# EAGLE design µ-USBasp_v1.1 (EAGLE 6.3)
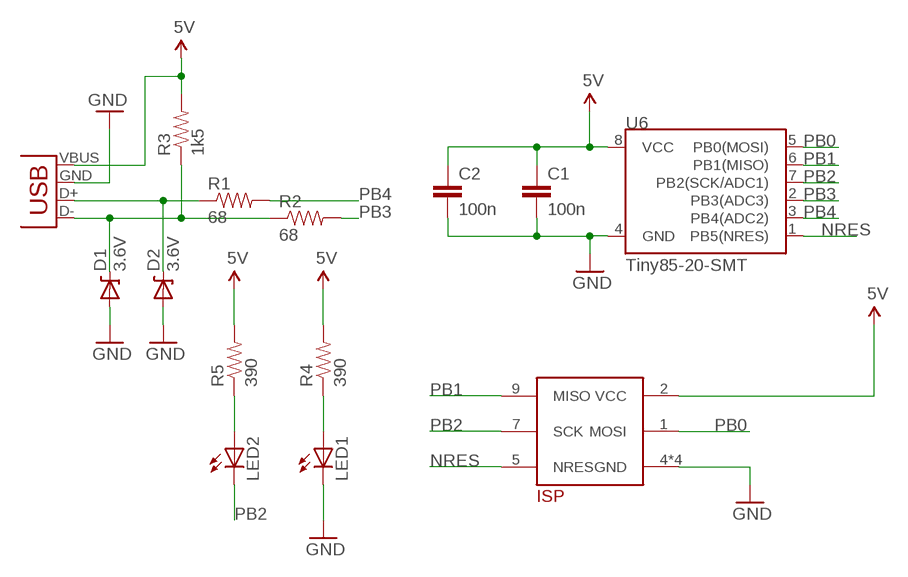
[diagram p0: schematic, sheet 1]

## Parts
C1  100n  CAP0805  [0805]
C2  100n  CAP0805  [0805]
D1  3.6V  DIODE-ZENER-BZT52  [SOD-323]
D2  3.6V  DIODE-ZENER-BZT52  [SOD-323]
JP2  USB-A-H  [USB-A-H]
LED1  LEDCHIPLED_0805  [CHIPLED_0805]
LED2  LEDCHIPLED_0805  [CHIPLED_0805]
R1  68  RESISTOR0805-RES  [0805]
R2  68  RESISTOR0805-RES  [0805]
R3  1k5  RESISTOR0805-RES  [0805]
R4  390  RESISTOR0805-RES  [0805]
R5  390  RESISTOR0805-RES  [0805]
U6  Tiny85-20-SMT  ATTINY45TINY85-20-SMT  [SO08-EIAJ]
U$1  TB_ISPEDGE_2X5_LONG  [ISP_EDGE2X5_LONG]

## Nets
5V [Power]: C1.1 C2.1 JP2.VBUS(GND) R3.2 R4.2 R5.2 U6.8(VCC) U$1.2(VCC)
GND [Power]: C1.2 C2.2 D1.2(A) D2.2(A) JP2.GND(VBUS) LED1.C U6.4(GND) U$1.4(GND) U$1.6(GND) U$1.8(GND) U$1.10(GND)
N$1: D1.1(C) JP2.D-(D+) R2.1 R3.1
N$2: D2.1(C) JP2.D+(D-) R1.1
N$3: LED1.A R4.1
N$5: LED2.A R5.1
NRES: U6.1(PB5(NRES)) U$1.5(NRES)
PB0: U6.5(PB0(MOSI)) U$1.1(MOSI)
PB1: U6.6(PB1(MISO)) U$1.9(MISO)
PB2: LED2.C U6.7(PB2(SCK/ADC1)) U$1.7(SCK)
PB3: R2.2 U6.2(PB3(ADC3))
PB4: R1.2 U6.3(PB4(ADC2))

## Library data of the parts
C1 C2 = SparkFun-Capacitors:CAP: Capacitor Standard 0603 ceramic capacitor, and 0.1" leaded capacitor.
D1 D2 = SparkFun-DiscreteSemi:DIODE-ZENER: Zener Diode Production Part - 8199 3.4V Zener Voltage
JP2 = SparkFun-Connectors:USB: USB Connectors USB-B-PTH is fully proven SKU : PRT-00139/CONN-08278 USB-miniB is fully proven SKU : PRT-00587 USB-A-PCB is untested. USB-A-H is throughly reviewed, but untested. Spark Fun Electronics SKU : PRT-00437 USB-B-SMT is throughly reviewed, but untested. Needs silkscreen touching up. USB-A-S has not been used/tested USB-MB-H has not been used/tested USB-MICROB has been used. CONN-09505
LED1 LED2 = led:LED: LED OSRAM: - CHIPLED LG R971, LG N971, LY N971, LG Q971, LY Q971, LO R971, LY R971 LH N974, LH R974 LS Q976, LO Q976, LY Q976 LO Q996 - Hyper CHIPLED LW Q18S LB Q993, LB Q99A, LB R99A - SideLED LS A670, LO A670, LY A670, LG A670, LP A670 LB A673, LV A673, LT A673, LW A673 LH A674 LY A675 LS A676, LA A676, LO A676, LY A676, LW A676 LS A679, LY A679, LG A679 - Hyper Micro SIDELED® LS Y876, LA Y876, LO Y876, LY Y876 LT Y87S - SmartLED LW L88C, LW L88S LB L89C, LB L89S, LG L890 LS L89K, LO L89K, LY L89K LS L896, LA L896, LO L896, LY L896 - TOPLED LS T670, LO T670, LY T670, LG T670, LP T670 LSG T670, LSP T670, LSY T670, LOP T670, LYG T670 LG T671, LOG T671, LSG T671 LB T673, LV T673, LT T673, LW T673 LH T674 LS T676, LA T676, LO T676, LY T676, LB T676, LH T676, LSB T676, LW T676 LB T67C, LV T67C, LT T67C, LS T67K, LO T67K, LY T67K, LW E67C LS E67B, LA E67B, LO E67B, LY E67B, LB E67C, LV E67C, LT E67C LW T67C LS T679, LY T679, LG T679 LS T770, LO T770, LY T770, LG T770, LP T770 LB T773, LV T773, LT T773, LW T773 LH T774 LS E675, LA E675, LY E675, LS T675 LS T776, LA T776, LO T776, LY T776, LB T776 LHGB T686 LT T68C, LB T68C - Hyper Mini TOPLED® LB M676 - Mini TOPLED Santana® LG M470 LS M47K, LO M47K, LY M47K Source: http://www.osram.convergy.de LUXEON: - LUMILED® LXK2-PW12-R00, LXK2-PW12-S00, LXK2-PW14-U00, LXK2-PW14-V00 LXK2-PM12-R00, LXK2-PM12-S00, LXK2-PM14-U00 LXK2-PE12-Q00, LXK2-PE12-R00, LXK2-PE12-S00, LXK2-PE14-T00, LXK2-PE14-U00 LXK2-PB12-K00, LXK2-PB12-L00, LXK2-PB12-M00, LXK2-PB14-N00, LXK2-PB14-P00, LXK2-PB14-Q00 LXK2-PR12-L00, LXK2-PR12-M00, LXK2-PR14-Q00, LXK2-PR14-R00 LXK2-PD12-Q00, LXK2-PD12-R00, LXK2-PD12-S00 LXK2-PH12-R00, LXK2-PH12-S00 LXK2-PL12-P00, LXK2-PL12-Q00, LXK2-PL12-R00 Source: www.luxeon.com KINGBRIGHT: KA-3528ASYC Source: www.kingbright.com
R1-R5 = SparkFun-Passives:RESISTOR: Resistor Basic schematic elements and footprints for 0603, 1206, and PTH resistors.
U6 = SparkFun-DigitalIC:ATTINY45: Atmel 8-pin 2/4/8kB flash uC; PROD_ID: IC-09092
U$1 = tb_custom:TB_ISPEDGE_2X5_LONG: AVR ISP connector at PCB edge - long pads for soldering

## Net classes
1 Power: width 0.305 mm, clearance 0.305 mm

## Board
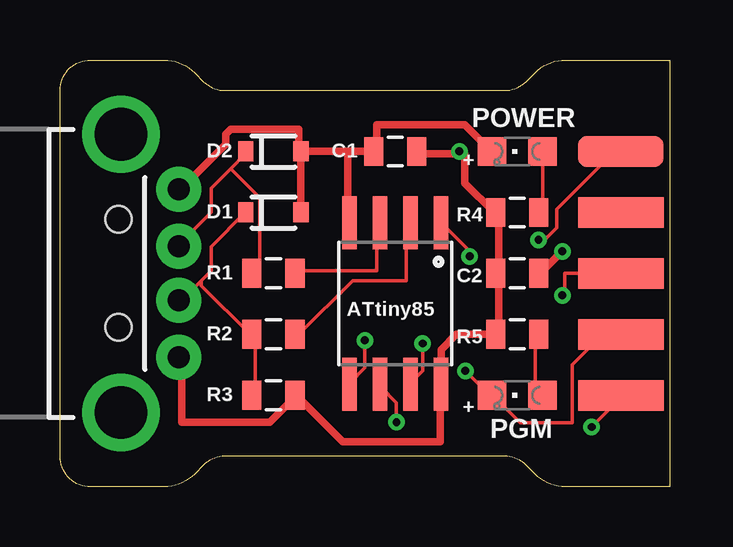
[diagram p1: board, top side]
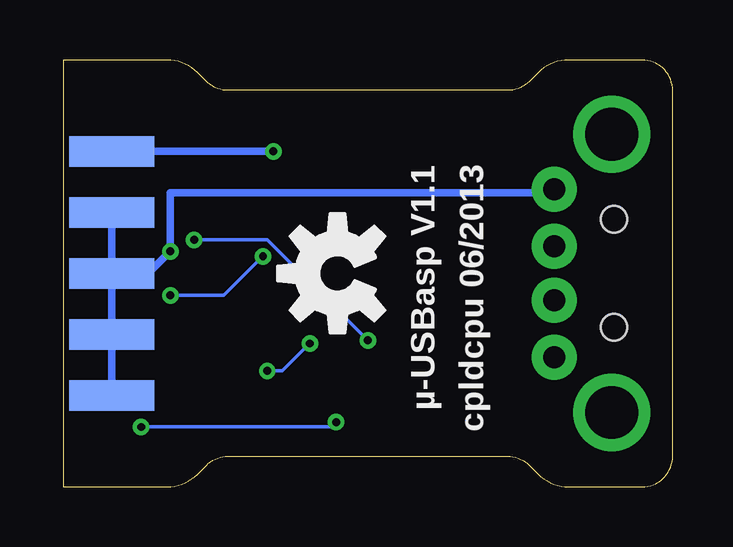
[diagram p2: board, bottom side, seen from below]

Size 25.4 x 17.78 mm. Coordinates in mm from the lower left corner, seen from the top.
Outline: 1.27,0 arc-90 0,1.27 0,16.51 arc-90 1.27,17.78 4.34,17.78 arc-45 5.61,17.25 5.98,16.88 arc45 6.88,16.51 18.52,16.51 arc45 19.42,16.88 19.79,17.25 arc-45 21.06,17.78 25.4,17.78 25.4,0 21.06,0 arc-45 19.79,0.53 19.42,0.9 arc45 18.52,1.27 6.88,1.27 arc45 5.98,0.9 5.61,0.53 arc-45 4.34,0 1.27,0
Copper layers (1*16): Top 0.0356mm / dielectric 1.5011mm / Bottom 0.0356mm
Design rules "LaenPCBOrder": minimum track width 6mil, minimum drill 13mil, track to track 6mil, track to pad 6mil, pad to pad 6mil, via to via 6mil, smd to smd 6mil, copper to edge 15mil, drill to drill 6mil, minimum pad ring 7mil, minimum via ring 7mil, stop-mask expansion 4mil, vias tented up to drill 0mil, thermal gap 10mil

### Footprints (pad centres in the part's own frame; a part is rotated, then mirrored left to right if it is on the bottom)
0805 = smd 0.8 x 1.2: 1 -0.9,0; 2 0.9,0
SOD-323 = smd 0.63 x 0.83: 1 -1.15,0; 2 1.15,0
USB-A-H = drill 0.914 pad 1.88: D+ 2.4,1.127; D- 2.4,-1.127; GND 2.4,3.5; VBUS 2.4,-3.5 | drill 2.2: GND2 0,-5.8; GND3 0,5.8 | hole 1.1: -0.1,2.25; -0.1,-2.25
CHIPLED_0805 = smd 1.2 x 1.2: A 0,-1.05; C 0,1.05
SO08-EIAJ = smd 0.61 x 2.21: 1 -1.905,-3.378; 2 -0.635,-3.378; 3 0.635,-3.378; 4 1.905,-3.378; 5 1.905,3.353; 6 0.635,3.353; 7 -0.635,3.353; 8 -1.905,3.353
ISP_EDGE2X5_LONG = smd 3.556 x 1.27: 1 -0.762,5.08; 3 -0.762,2.54; 5 -0.762,0; 7 -0.762,-2.54; 9 -0.762,-5.08 | smd 3.556 x 1.27 bottom: 2 -0.762,5.08; 4 -0.762,2.54; 6 -0.762,0; 8 -0.762,-2.54; 10 -0.762,-5.08

### Placement (x,y rotation side)
C1  13.97,13.97 180 top
C2  19.05,8.89 0 top
D1  8.89,11.43 0 top
D2  8.89,13.97 0 top
JP2  2.54,8.89 0 top
LED1  19.05,13.97 90 top
LED2  19.05,3.81 90 top
R1  8.89,8.89 0 top
R2  8.89,6.35 0 top
R3  8.89,3.81 0 top
R4  19.05,11.43 180 top
R5  19.05,6.35 180 top
U6  13.97,7.62 180 top
U$1  24.13,8.89 0 top
U$2  [OSHW-LOGO-M]  13.97,8.89 90 bottom

### Tracks (layer width: path | path; a pad name or v marks a point on that pad's centre or on a via)
5V  (via drill 0.33)
  Top 0.305: JP2.VBUS 5.08,5.33 5.08,2.69 8.74,2.69 9.75,3.71 R3.2 9.96,3.71 11.79,1.88 15.85,1.88 15.85,4.12 U6.8 15.88,5.71 16.51,6.35 R5.2 18.29,6.35 18.29,8.79 C2.1 18.29,8.99 18.29,11.43 R4.2 18.09,11.43 16.87,12.65 16.87,13.87 16.64,13.87 | 16.64,13.87 15.04,13.87 C1.1 | v16.64,13.97 16.64,13.87
  Bottom 0.305: v16.64,13.97 U$1.2
GND  (via drill 0.33)
  Top 0.305: v20.93,9.8 20.12,8.99 C2.2 | U6.4 11.99,11.02 11.99,13.97 | 9.96,13.87 D2.2 | 9.96,11.43 D1.2 D2.2 | 13.01,14.07 C1.2 | 10.16,14.07 D2.2 | LED1.C 17.88,14.07 16.87,15.09 13.21,15.09 13.21,14.07 C1.2 | JP2.GND 5.08,12.45 6.91,14.28 6.91,14.68 7.11,14.88 9.96,14.88 9.96,14.07 D2.2 | 11.99,13.97 C1.2 | 11.99,13.97 D2.2
  Bottom 0.305: U$1.10 U$1.8 U$1.6 23.37,8.99 | 23.37,8.99 21.74,8.99 v20.93,9.8 20.93,12.24 5.08,12.24 JP2.GND | 23.37,8.99 U$1.4
N$1
  Top 0.152: R3.1 8.13,3.91 8.13,6.35 R2.1 7.92,6.35 5.89,8.38 5.89,8.59 | 5.89,8.59 5.08,7.77 JP2.D- | 5.89,8.59 6.3,8.99 6.3,10.01 7.72,11.43 D1.1
N$2
  Top 0.152: 7.11,13.26 6.3,12.45 6.3,11.43 5.08,10.21 JP2.D+ | 7.11,13.26 7.72,13.87 D2.1 | 7.11,13.26 8.33,12.04 8.33,9.2 8.13,8.99 R1.1
N$3
  Top 0.152: R4.1 20.12,11.43 20.12,13.87 LED1.A
N$5
  Top 0.152: 20.12,6.35 R5.1 | 19.81,6.3 R5.1 | LED2.A 20.07,3.81 19.81,4.06 19.81,6.22 R5.1
NRES  (via drill 0.33)
  Top 0.152: U6.1 17.07,9.8 v17.07,9.6 | U$1.5 21.03,8.89 21.03,7.98 v20.93,7.98
  Bottom 0.152: v17.07,9.6 18.69,7.98 v20.93,7.98
PB0  (via drill 0.33)
  Top 0.152: 22.96,13.87 23.37,13.87 U$1.1 22.99,13.84 20.7,11.56 20.7,10.79 20.19,10.29 v19.94,10.29 | v12.7,6.1 12.7,4.95 12.06,4.32 U6.5
  Bottom 0.152: v12.7,6.1 16.89,10.29 v19.94,10.29
PB1  (via drill 0.33)
  Top 0.152: v14.02,2.69 14.02,3.5 13.41,4.12 U6.6 | v22.15,2.49 23.37,3.71 U$1.9
  Bottom 0.152: v14.02,2.69 14.22,2.49 v22.15,2.49
PB2  (via drill 0.33)
  Top 0.152: U$1.7 23.32,6.3 22.55,6.3 U$1.7 | U$1.7 22.61,6.35 21.34,5.08 21.34,2.67 19.18,2.67 18.03,3.81 LED2.C 17.91,3.81 v16.89,4.83 | v15.11,5.97 15.11,4.83 14.61,4.32 U6.7
  Bottom 0.152: v15.11,5.97 16.26,4.83 v16.89,4.83
PB3
  Top 0.152: R2.2 9.96,6.35 12.19,8.59 14.43,8.59 14.43,10.82 U6.2
PB4
  Top 0.152: R1.2 9.96,8.99 13.21,8.99 13.21,10.82 U6.3

### Text on the board
tPlace: POWER | D2 | C1 | + | D1 | R4 | R1 | C2 | ATtiny85 | R2 | R5 | R3 | + | PGM
bPlace: µ-USBasp V1.1 | cpldcpu 06/2013